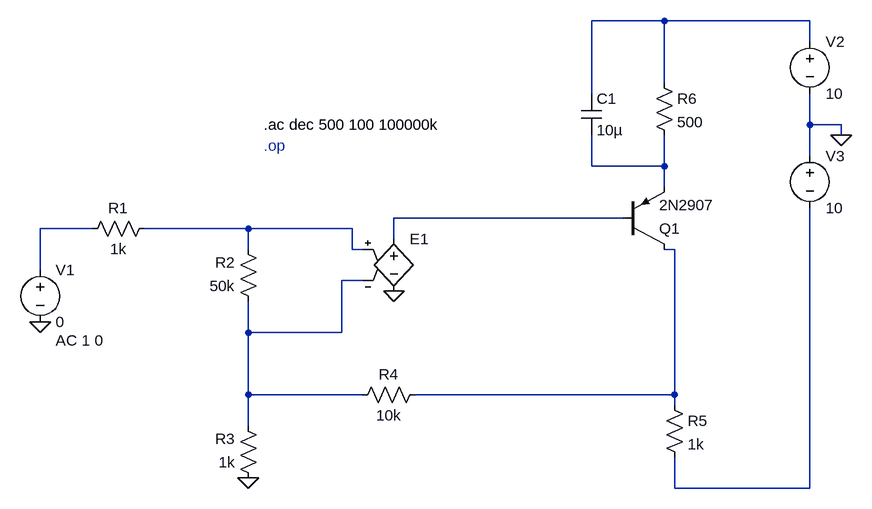
[diagram p0: schematic Transferencia4.asc]
Transferencia4.asc, the LTspice schematic file:
Version 4
SHEET 1 1012 1092
WIRE 656 -192 544 -192
WIRE 880 -192 656 -192
WIRE 880 -160 880 -192
WIRE 656 -96 656 -192
WIRE 544 -80 544 -192
WIRE 880 -32 880 -80
WIRE 928 -32 880 -32
WIRE 928 -16 928 -32
WIRE 880 16 880 -32
WIRE 544 32 544 -16
WIRE 656 32 656 -16
WIRE 656 32 544 32
WIRE 656 64 656 32
WIRE 592 112 240 112
WIRE -224 128 -304 128
WIRE 16 128 -144 128
WIRE 176 128 16 128
WIRE 240 144 240 112
WIRE 16 160 16 128
WIRE 176 160 176 128
WIRE 192 160 176 160
WIRE 672 160 656 160
WIRE -304 192 -304 128
WIRE 192 208 160 208
WIRE 16 288 16 240
WIRE 160 288 160 208
WIRE 160 288 16 288
WIRE 16 384 16 288
WIRE 192 384 16 384
WIRE 672 384 672 160
WIRE 672 384 272 384
WIRE 672 400 672 384
WIRE 16 432 16 384
WIRE 672 528 672 480
WIRE 880 528 880 96
WIRE 880 528 672 528
FLAG 240 224 0
FLAG -304 272 0
FLAG 16 512 0
FLAG 928 -16 0
DATAFLAG 656 16 ""
DATAFLAG 432 112 ""
DATAFLAG 112 128 ""
DATAFLAG 112 288 ""
DATAFLAG -288 128 ""
DATAFLAG 656 384 ""
SYMBOL e 240 128 R0
WINDOW 3 24 96 Invisible 2
SYMATTR Value -100/(1+s/62831.8)
SYMATTR InstName E1
SYMATTR SpiceModel laplace
SYMBOL voltage -304 176 R0
WINDOW 123 24 124 Left 2
WINDOW 39 0 0 Left 0
SYMATTR Value2 AC 1 0
SYMATTR InstName V1
SYMATTR Value 0
SYMBOL res -128 112 R90
WINDOW 0 0 56 VBottom 2
WINDOW 3 32 56 VTop 2
SYMATTR InstName R1
SYMATTR Value 1k
SYMBOL res 32 256 R180
WINDOW 0 36 76 Left 2
WINDOW 3 36 40 Left 2
SYMATTR InstName R2
SYMATTR Value 50k
SYMBOL res 32 528 R180
WINDOW 0 36 76 Left 2
WINDOW 3 36 40 Left 2
SYMATTR InstName R3
SYMATTR Value 1k
SYMBOL res 176 400 R270
WINDOW 0 32 56 VTop 2
WINDOW 3 0 56 VBottom 2
SYMATTR InstName R4
SYMATTR Value 10k
SYMBOL res 656 384 R0
SYMATTR InstName R5
SYMATTR Value 1k
SYMBOL pnp 592 160 M180
SYMATTR InstName Q1
SYMATTR Value 2N2907
SYMBOL res 640 -112 R0
SYMATTR InstName R6
SYMATTR Value 500
SYMBOL voltage 880 -176 R0
WINDOW 123 0 0 Left 0
WINDOW 39 0 0 Left 0
SYMATTR InstName V2
SYMATTR Value 10
SYMBOL voltage 880 0 R0
WINDOW 123 0 0 Left 0
WINDOW 39 0 0 Left 0
SYMATTR InstName V3
SYMATTR Value 10
SYMBOL cap 528 -80 R0
SYMATTR InstName C1
SYMATTR Value 10µ
TEXT 40 0 Left 2 ;.op
TEXT 40 -32 Left 2 !.ac dec 500 100 100000k

The netlist it stands for:
* Transferencia4.asc
E1 N003 0 N005 N007 laplace -100/(1+s/62831.8)
V1 N004 0 0 AC 1 0
R1 N005 N004 1k
R2 N007 N005 50k
R3 0 N007 1k
R4 N007 N006 10k
R5 N006 N008 1k
Q1 N006 N003 N002 0 2N2907
R6 N001 N002 500
V2 N001 0 10
V3 0 N008 10
C1 N001 N002 10µ
.model NPN NPN
.model PNP PNP
.lib standard.bjt
* .op
.ac dec 500 100 100000k
.backanno
.end